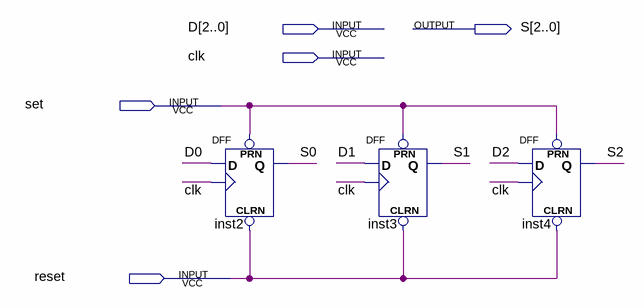
[diagram p0: schematic sheet]
// Quartus schematic DFF3.bdf as structural Verilog: 3 symbols, 5 pins
module DFF3 (
  input  [2:0] D,
  input  clk,
  input  set,
  input  reset,
  output [2:0] S
);

  DFF inst2 (.CLRN(reset), .CLK(clk), .D(D[0]), .PRN(set), .Q(S[0]));
  DFF inst3 (.CLRN(reset), .CLK(clk), .D(D[1]), .PRN(set), .Q(S[1]));
  DFF inst4 (.CLRN(reset), .CLK(clk), .D(D[2]), .PRN(set), .Q(S[2]));
endmodule
